# Altium schematic sheet ESP8266_EV.schdoc
size 282 x 206 mm
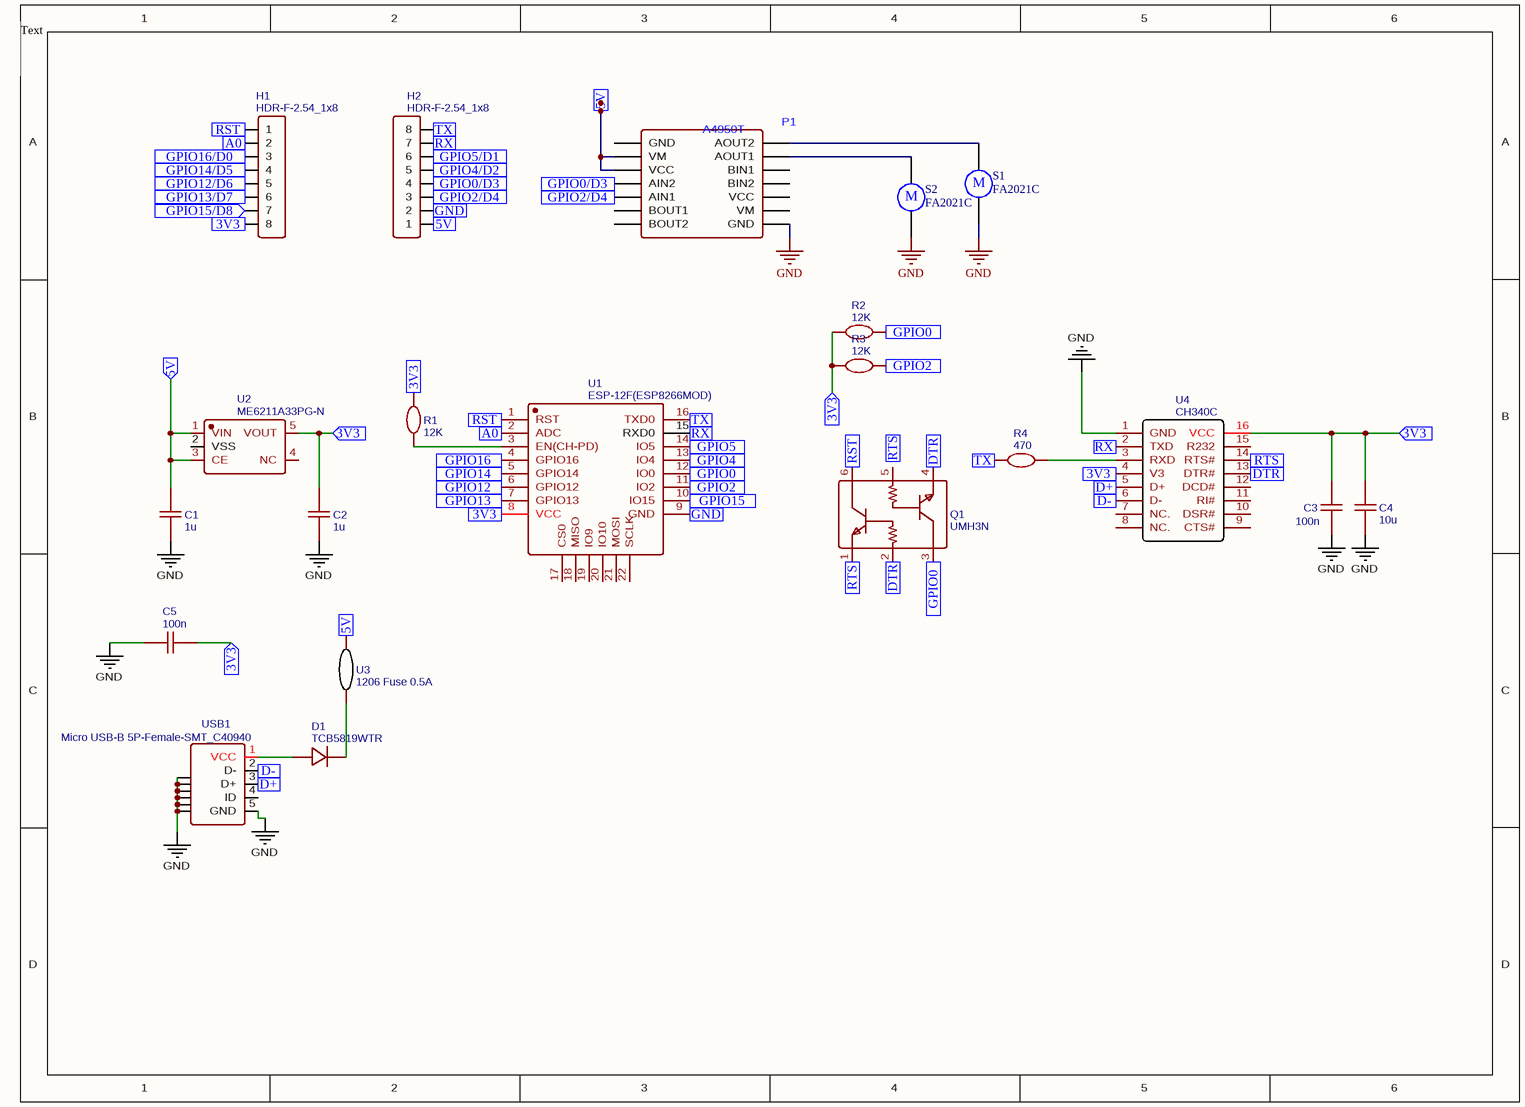
[diagram p0: ESP8266_EV.schdoc]

## Parts
C1  1u  [C1206]
C2  1u  [C1206]
C3  100n  [C1206]
C4  10u  [C1206]
C5  100n  [C1206]
D1  TCB5819WTR  [SOD-123F_L2.8-W1.8-LS3.7-RD]
H1  HDR-F-2.54_1x8  [HDR-F-2.54_1X8]
H2  HDR-F-2.54_1x8  [HDR-F-2.54_1X8]
P1  A4950T  [A4950 DUAL DRIVER MODULE]
Q1  UMH3N  [SC-70-6_L2.2-W1.3-P0.65-LS2.1-BR]
R1  12K  [R_AXIAL-0.4]
R2  12K  [R_AXIAL-0.4]
R3  12K  [R_AXIAL-0.4]
R4  470  [R_AXIAL-0.4]
S1  FA2021C  [RB5-10.5]
S2  FA2021C  [RB5-10.5]
U1  ESP-12F(ESP8266MOD)  [WIFIM-SMD_ESP-12F-ESP8266MOD]
U2  ME6211A33PG-N  [SOT-23-5_L3.0-W1.7-P0.95-LS2.8-BL]
U3  1206 Fuse 0.5A  [1206 FUSE]
U4  CH340C  [SOP-16_L10.0-W3.9-P1.27-LS6.0-BL]
USB1  Micro USB-B 5P-Female-SMT_C40940  [MICRO-USB-SMD_5P-P0.65-H-M_MICRO-5P]

## Ports
3V3 (in), 5V (in), A0 (in), D+ (in), D- (in), DTR (in), GND (in), GPIO0 (in), GPIO0/D3 (in), GPIO2 (in), GPIO2/D4 (in), GPIO4 (in), GPIO4/D2 (in), GPIO5 (in), GPIO5/D1 (in), GPIO12 (in), GPIO12/D6 (in), GPIO13 (in), GPIO13/D7 (in), GPIO14 (in), GPIO14/D5 (in), GPIO15 (in), GPIO15/D8 (in), GPIO16 (in), GPIO16/D0 (in), RST (in), RTS (in), RX (in), TX (in)

## Nets
GND: C1.1 C2.1 C3.1 C4.1 C5.2 P1.8(GND) S1.2 S2.2 U4.1(GND) USB1.5(GND) USB1.6 USB1.7 USB1.8 USB1.9 USB1.10 USB1.11
3V3: C2.2 C3.2 C4.2 C5.1 H1.8 R1.1 R2.1 R3.1 U1.8(VCC) U2.5(VOUT) U4.4(V3) U4.16(VCC) ; port 3V3
5V: C1.2 H2.1 P1.2(VM) P1.3(VCC) U2.1(VIN) U2.3(CE) U3.2 ; port 5V
A0: H1.2 U1.2(ADC) ; port A0
D+: U4.5(D+) USB1.3(D+) ; port D+
D-: U4.6(D-) USB1.2(D-) ; port D-
DTR: Q1.2(B) Q1.4(E) U4.13(DTR#) ; port DTR
GND: H2.2 U1.9(GND) ; port GND  [a separate net that carries the same name]
GPIO0: Q1.3(C) R2.2 U1.12(IO0) ; port GPIO0
GPIO0/D3: H2.4 P1.4(AIN2) ; port GPIO0/D3
GPIO2: R3.2 U1.11(IO2) ; port GPIO2
GPIO2/D4: H2.3 P1.5(AIN1) ; port GPIO2/D4
GPIO4: U1.13(IO4) ; port GPIO4
GPIO4/D2: H2.5 ; port GPIO4/D2
GPIO5: U1.14(IO5) ; port GPIO5
GPIO5/D1: H2.6 ; port GPIO5/D1
GPIO12: U1.6(GPIO12) ; port GPIO12
GPIO12/D6: H1.5 ; port GPIO12/D6
GPIO13: U1.7(GPIO13) ; port GPIO13
GPIO13/D7: H1.6 ; port GPIO13/D7
GPIO14: U1.5(GPIO14) ; port GPIO14
GPIO14/D5: H1.4 ; port GPIO14/D5
GPIO15: U1.10(IO15) ; port GPIO15
GPIO15/D8: H1.7 ; port GPIO15/D8
GPIO16: U1.4(GPIO16) ; port GPIO16
GPIO16/D0: H1.3 ; port GPIO16/D0
RST: H1.1 Q1.6(C) U1.1(RST) ; port RST
RTS: Q1.1(E) U4.14(RTS#) ; port RTS
RX: H2.7 U1.15(RXD0) U4.2(TXD) ; port RX
TX: H2.8 R4.1 U1.16(TXD0) ; port TX
NetD1_1: D1.1(K) U3.1
NetD1_2: D1.2(A) USB1.1(VCC)
NetP1_13: P1.13(AOUT1) S2.1
NetP1_14: P1.14(AOUT2) S1.1
NetR1_2: R1.2 U1.3(EN(CH-PD))
NetR4_2: R4.2 U4.3(RXD)

Not connected (* = marked no-connect by the designer): P1 1(GND) 6(BOUT1) 7(BOUT2) 9(VM) 10(VCC) 11(BIN2) 12(BIN1); Q1 5(B); U1 17(CS0) 18(MISO) 19(IO9) 20(IO10) 21(MOSI) 22(SCLK); U2 2(VSS) 4(NC); U4 7(NC.) 8(NC.) 9(CTS#) 10(DSR#) 11(RI#) 12(DCD#) 15(R232); USB1 4(ID)

## Notes on the sheet
- Text
- (in symbol Motor) M

## Library data of the parts
C1 C2 = 1u: nameAlias: Value(F); Contributor: LCEDA_Lib; spicePre: C; spiceSymbolName: C_1206_US
C3 C5 = 100n: nameAlias: Value(F); Contributor: LCEDA_Lib; spicePre: C; spiceSymbolName: C_1206_US
C4 = 10u: nameAlias: Value(F); Contributor: LCEDA_Lib; spicePre: C; spiceSymbolName: C_1206_US
D1 = TCB5819WTR: BOM_Manufacturer: Tak Cheong; Contributor: LCSC; BOM_Supplier: LCSC; BOM_Supplier Part: C261186; BOM_Manufacturer Part: TCB5819WTR; spicePre: D; spiceSymbolName: TCB5819WTR
H1 H2 = HDR-F-2.54_1x8: Contributor: LCEDA_Lib; BOM_Supplier Part: C225505; BOM_Supplier: LCSC; spicePre: H; spiceSymbolName: HDR-F-2.54_1x8
P1 = A4950 DUAL MOTOR DRIVER MODULE
Q1 = UMH3N: BOM_Manufacturer: CJ; SMT Type: Extend; BOM_Supplier: LCSC; BOM_Manufacturer Part: UMH3N; image: //image.lceda.cn/szlcsc/C62892.jpg; BOM_Supplier Part: C62892; BOM_LCSC Assembly: Yes; spicePre: Q; spiceSymbolName: UMH3N
R1-R3 = 12K: nameAlias: Value(Ω); Contributor: LCEDA_Lib; spicePre: R; spiceSymbolName: R_AXIAL-0.4_EU
R4 = 470: nameAlias: Value(Ω); Contributor: LCEDA_Lib; spicePre: R; spiceSymbolName: R_AXIAL-0.4_EU
S1 = Motor: Motor, General Kind; Published: 24-Mar-1999; LatestRevisionDate: 17-Jul-2002; LatestRevisionNote: Re-released for DXP Platform.; PackageReference: RB5-10.5; Publisher: Altium Limited; PackageDescription: Capacitor (Radial); 2 Leads
S2 = Motor: Solenoid Valve; Published: 24-Mar-1999; LatestRevisionDate: 17-Jul-2002; LatestRevisionNote: Re-released for DXP Platform.; PackageReference: RB5-10.5; Publisher: Altium Limited; PackageDescription: Capacitor (Radial); 2 Leads
U1 = ESP-12F(ESP8266MOD): BOM_Manufacturer: Ai-Thinker; BOM_Supplier: LCSC; BOM_Manufacturer Part: ESP-12F(ESP8266MOD); BOM_Supplier Part: C82891; spicePre: U; spiceSymbolName: ESP-12F(ESP8266MOD)
U2 = ME6211A33PG-N: BOM_Manufacturer: Nanjing Micro One Elec; BOM_Manufacturer Part: ME6211C50M5G-N; Contributor: LCSC; BOM_Supplier: LCSC; BOM_Supplier Part: C236670; spicePre: U; spiceSymbolName: ME6211C50M5G-N
U3 = 1206 Fuse 0.5A: Contributor: HESPzIroN; spicePre: U; spiceSymbolName: 1206 Fuse
U4 = CH340C: BOM_Manufacturer: WCH; SMT Type: Extend; Contributor: marphxl; BOM_Supplier: LCSC; BOM_Manufacturer Part: CH340C; BOM_Supplier Part: C84681; BOM_LCSC Assembly: Yes; spicePre: U; spiceSymbolName: CH340C
USB1 = Micro USB-B 5P-Female-SMT_C40940: BOM_Manufacturer: ValuePro; Contributor: LCSC; BOM_Supplier: LCSC; BOM_Manufacturer Part: Micro USB-B 5P-Female-SMT; image: //image.lceda.cn/szlcsc/C40940.jpg; BOM_Supplier Part: C40940; spicePre: U; spiceSymbolName: Micro USB-B 5P-Female-SMT_C40940